# EAGLE design ece411-cdkm-main (EAGLE 5.10)
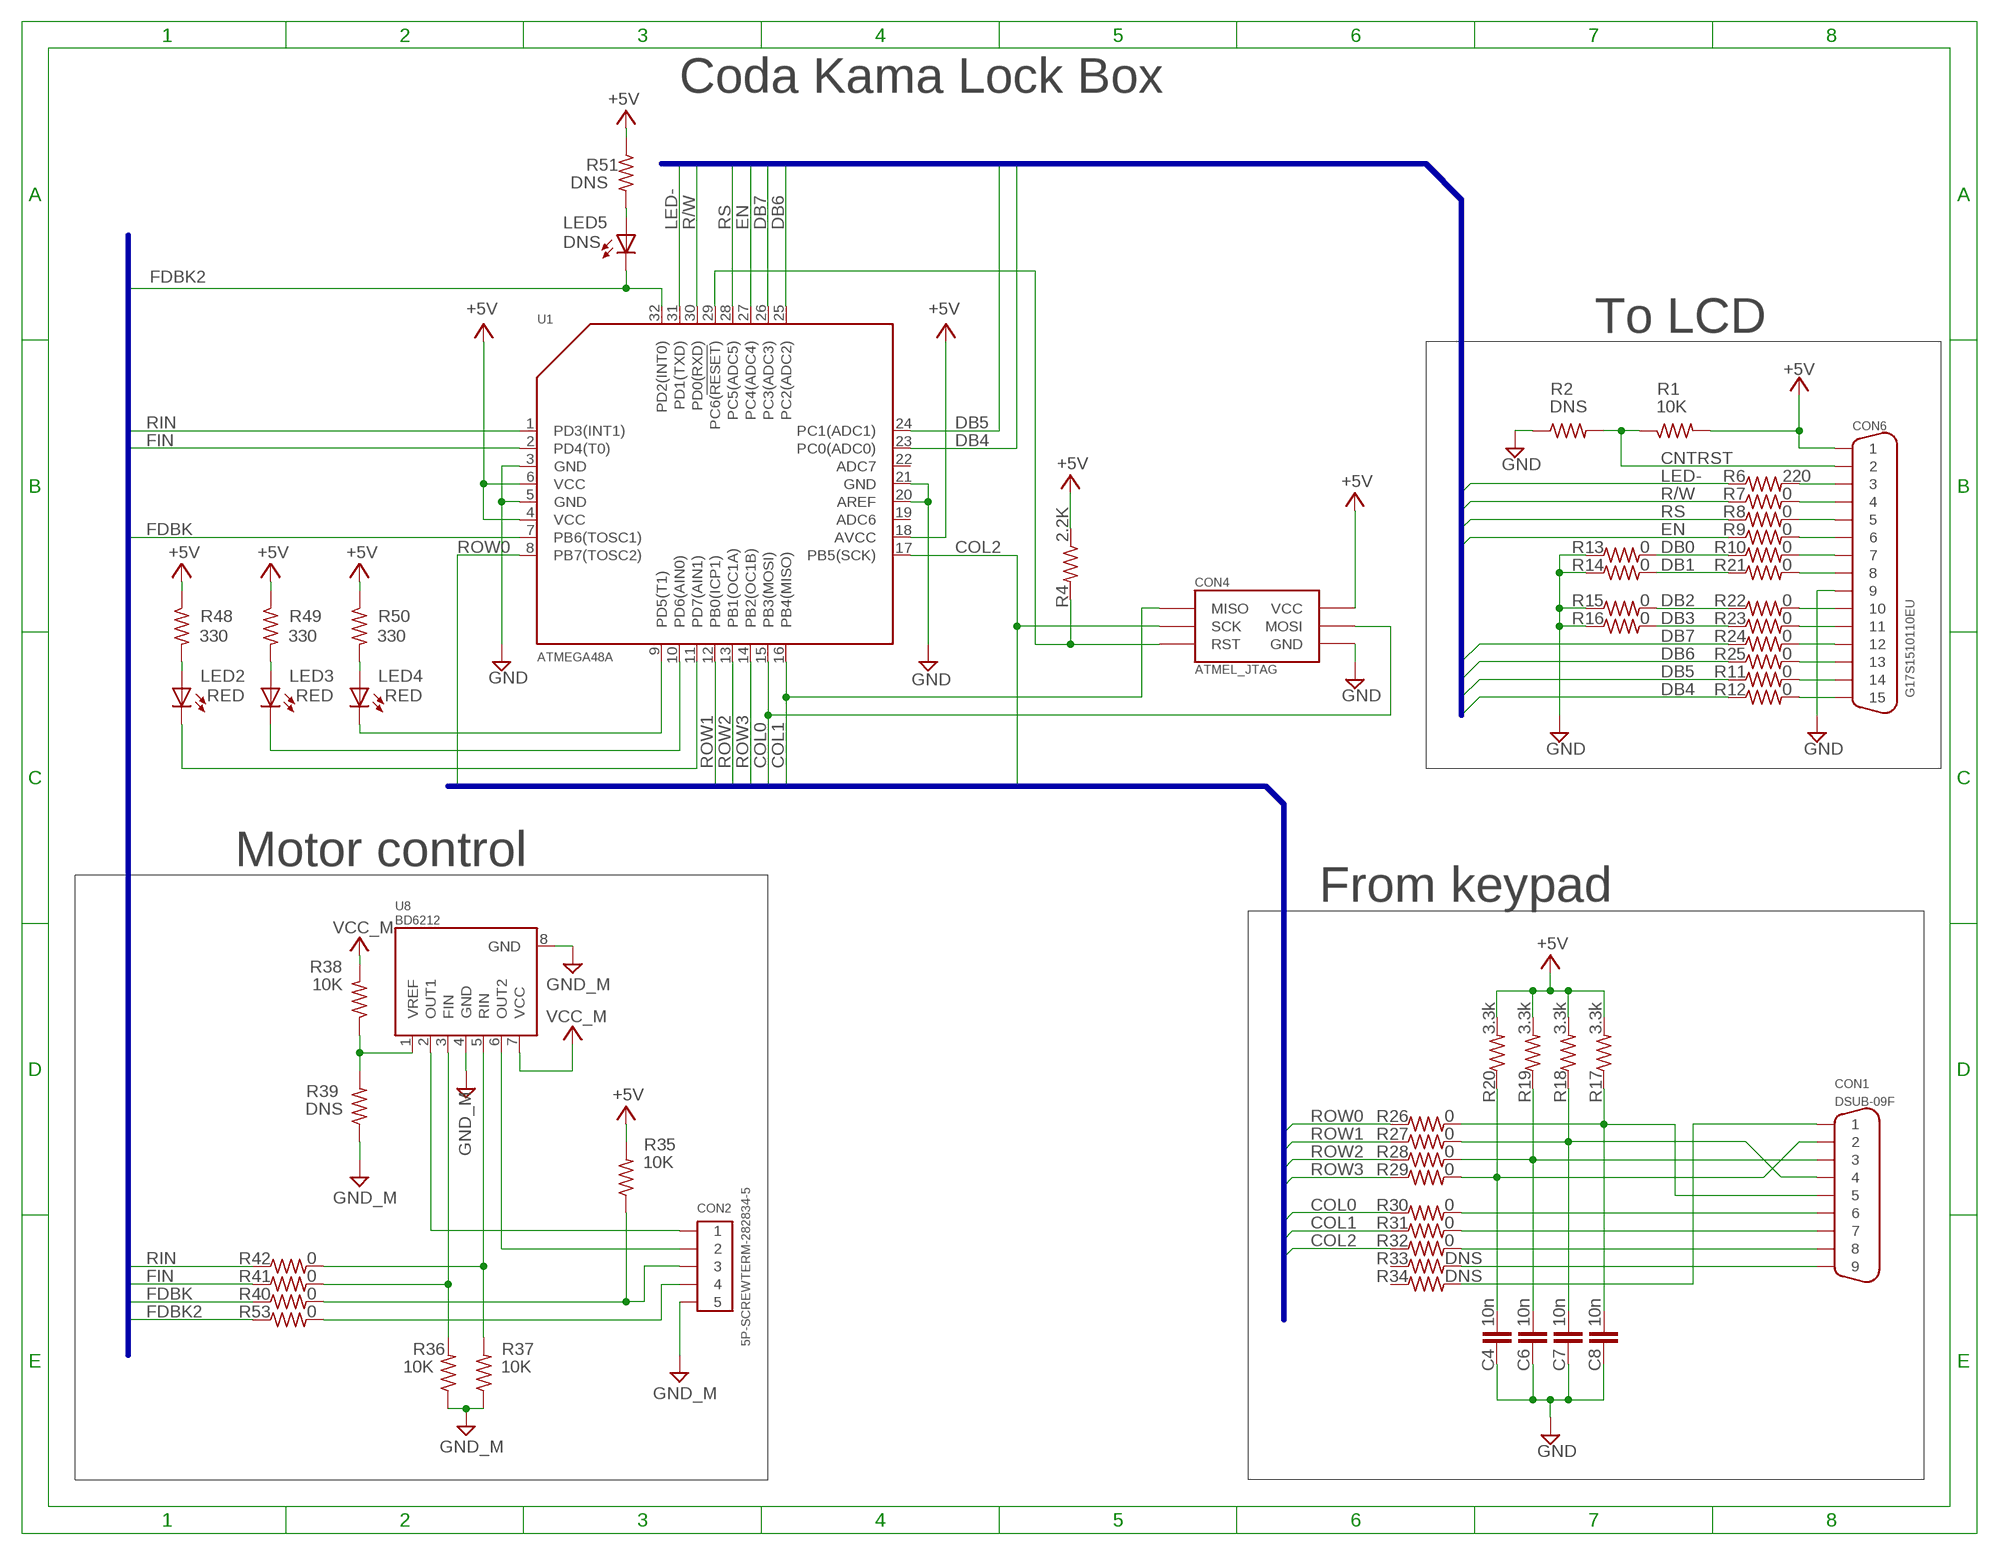
[diagram p0: schematic, sheet 1, part 1 of 2]
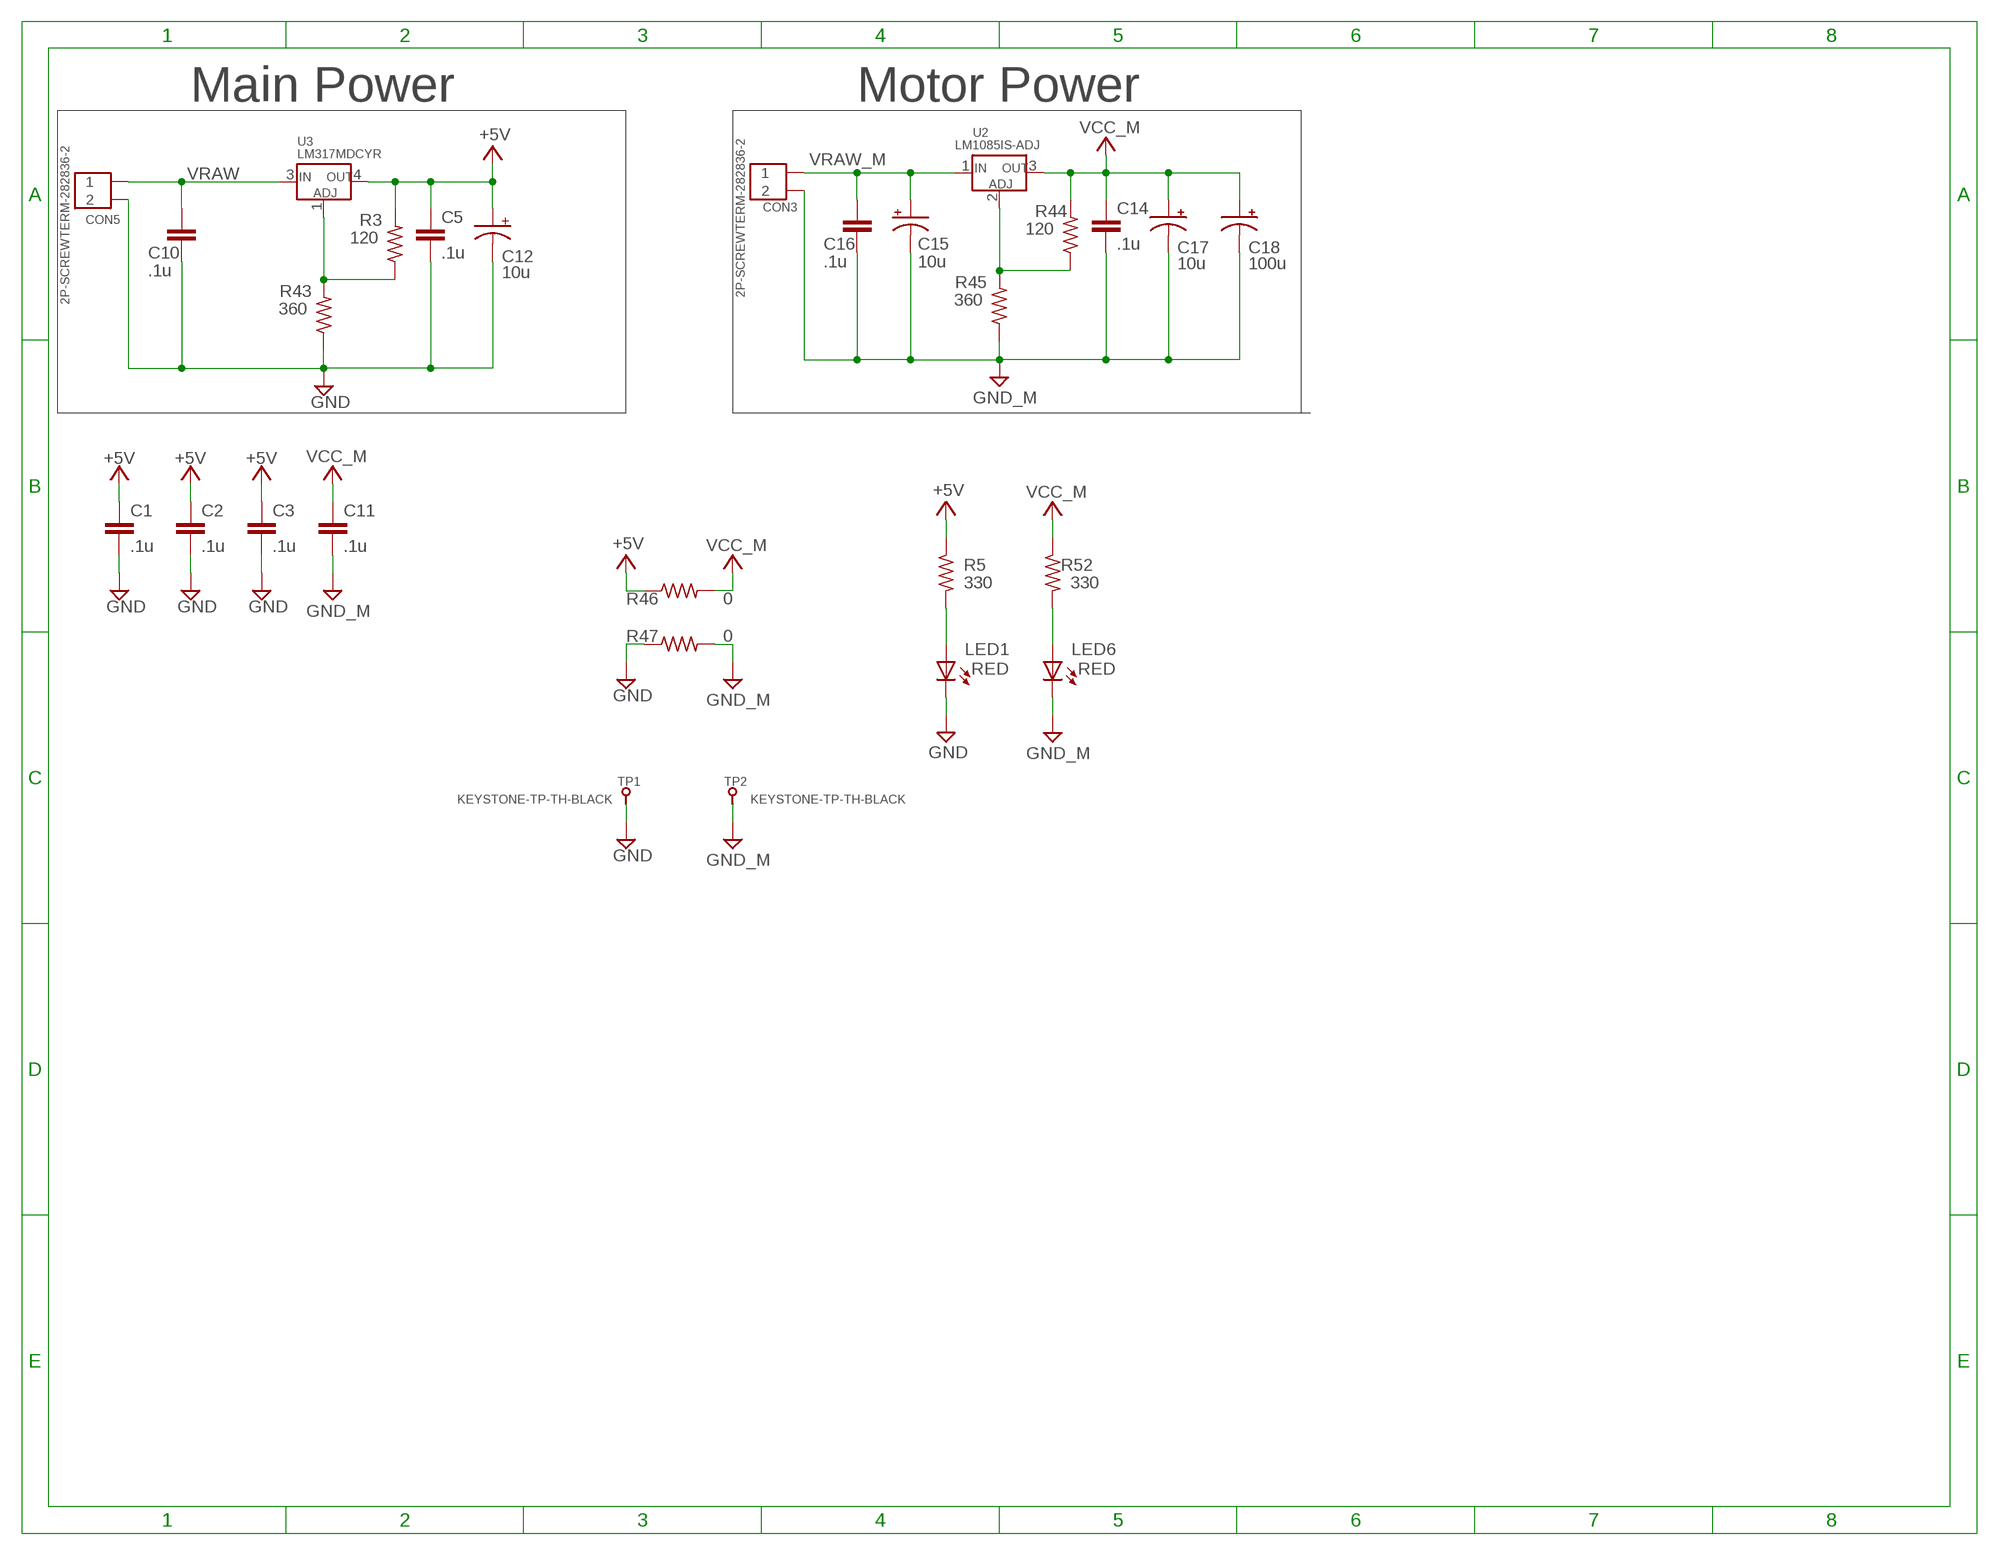
[diagram p1: schematic, sheet 1, part 2 of 2]

## Parts
C1  .1u  C-EUC0805  [C0805]
C2  .1u  C-EUC0805  [C0805]
C3  .1u  C-EUC0805  [C0805]
C4  10n  C-EUC0805  [C0805]
C5  .1u  C-EUC0805  [C0805]
C6  10n  C-EUC0805  [C0805]
C7  10n  C-EUC0805  [C0805]
C8  10n  C-EUC0805  [C0805]
C10  .1u  C-EUC0805  [C0805]
C11  .1u  C-EUC0805  [C0805]
C12  10u  CPOL-USE5-6  [E5-6]
C14  .1u  C-EUC0805  [C0805]
C15  10u  CPOL-USE5-6  [E5-6]
C16  .1u  C-EUC0805  [C0805]
C17  10u  CPOL-USE5-6  [E5-6]
C18  100u  CPOL-USE5-6  [E5-6]
CON1  DSUB-09F  [DSUB09M-SOLDER-EDGE]
CON2  5P-SCREWTERM-282834-5  [5P-TERMINALBLOCK-282834-5]
CON3  2P-SCREWTERM-282836-2  [2P-TERMINALBLOCK-282836-2]
CON4  ATMEL_JTAG  [3X2-100MIL]
CON5  2P-SCREWTERM-282836-2  [2P-TERMINALBLOCK-282836-2]
CON6  G17S1510110EU  DSUB-15F  [DSUB15F-SOLDER-EDGE]
LED1  RED  LEDCHIP-LED0805  [CHIP-LED0805]
LED2  RED  LEDCHIP-LED0805  [CHIP-LED0805]
LED3  RED  LEDCHIP-LED0805  [CHIP-LED0805]
LED4  RED  LEDCHIP-LED0805  [CHIP-LED0805]
LED5  DNS  LEDCHIP-LED0805  [CHIP-LED0805]
LED6  RED  LEDCHIP-LED0805  [CHIP-LED0805]
R1  10K  R-US_R0805  [R0805]
R2  DNS  R-US_R0805  [R0805]
R3  120  R-US_R0805  [R0805]
R4  2.2K  R-US_R0805  [R0805]
R5  330  R-US_R0805  [R0805]
R6  220  R-US_R0805  [R0805]
R7  0  R-US_R0805  [R0805]
R8  0  R-US_R0805  [R0805]
R9  0  R-US_R0805  [R0805]
R10  0  R-US_R0805  [R0805]
R11  0  R-US_R0805  [R0805]
R12  0  R-US_R0805  [R0805]
R13  0  R-US_R0805  [R0805]
R14  0  R-US_R0805  [R0805]
R15  0  R-US_R0805  [R0805]
R16  0  R-US_R0805  [R0805]
R17  3.3k  R-US_R0805  [R0805]
R18  3.3k  R-US_R0805  [R0805]
R19  3.3k  R-US_R0805  [R0805]
R20  3.3k  R-US_R0805  [R0805]
R21  0  R-US_R0805  [R0805]
R22  0  R-US_R0805  [R0805]
R23  0  R-US_R0805  [R0805]
R24  0  R-US_R0805  [R0805]
R25  0  R-US_R0805  [R0805]
R26  0  R-US_R0805  [R0805]
R27  0  R-US_R0805  [R0805]
R28  0  R-US_R0805  [R0805]
R29  0  R-US_R0805  [R0805]
R30  0  R-US_R0805  [R0805]
R31  0  R-US_R0805  [R0805]
R32  0  R-US_R0805  [R0805]
R33  DNS  R-US_R0805  [R0805]
R34  DNS  R-US_R0805  [R0805]
R35  10K  R-US_R0805  [R0805]
R36  10K  R-US_R0805  [R0805]
R37  10K  R-US_R0805  [R0805]
R38  10K  R-US_R0805  [R0805]
R39  DNS  R-US_R0805  [R0805]
R40  0  R-US_R0805  [R0805]
R41  0  R-US_R0805  [R0805]
R42  0  R-US_R0805  [R0805]
R43  360  R-US_R0805  [R0805]
R44  120  R-US_R0805  [R0805]
R45  360  R-US_R0805  [R0805]
R46  0  R-US_0207/10  [0207/10]
R47  0  R-US_0207/10  [0207/10]
R48  330  R-US_R0805  [R0805]
R49  330  R-US_R0805  [R0805]
R50  330  R-US_R0805  [R0805]
R51  DNS  R-US_R0805  [R0805]
R52  330  R-US_R0805  [R0805]
R53  0  R-US_R0805  [R0805]
TP1  KEYSTONE-TP-TH-BLACK  [KEYSTONE-TESTPOINT-MULTIPURPOSE]
TP2  KEYSTONE-TP-TH-BLACK  [KEYSTONE-TESTPOINT-MULTIPURPOSE]
U1  ATMEGA48A  [TQFP-32]
U2  LM1085IS-ADJ  [TO-263]
U3  LM317MDCYR  [DCY]
U8  BD6212  [HRP7]

## Nets
+5V: C1.1 C2.1 C3.1 C5.1 C12.+ CON4.P$6(VCC) CON6.1 R1.2 R3.2 R4.1 R5.1 R17.2 R18.2 R19.2 R20.2 R35.2 R46.1 R48.1 R49.1 R50.1 R51.1 U1.4(VCC) U1.6(VCC) U1.18(AVCC) U3.4(OUT)
CNTRST: CON6.2 R1.1 R2.2
COL0: CON4.P$5(MOSI) R30.1 U1.15(PB3(MOSI))
COL1: CON4.P$1(MISO) R31.1 U1.16(PB4(MISO))
COL2: CON4.P$2(SCK) R32.1 U1.17(PB5(SCK))
DB0: R10.1 R13.2
DB1: R14.2 R21.1
DB2: R15.2 R22.1
DB3: R16.2 R23.1
DB4: R12.1 U1.23(PC0(ADC0))
DB5: R11.1 U1.24(PC1(ADC1))
DB6: R25.1 U1.25(PC2(ADC2))
DB7: R24.1 U1.26(PC3(ADC3))
EN: R9.1 U1.27(PC4(ADC4))
FDBK: R40.1 U1.7(PB6(TOSC1))
FDBK2: LED5.C R53.1 U1.32(PD2(INT0))
FIN: R41.1 U1.2(PD4(T0))
GND: C1.2 C2.2 C3.2 C4.2 C5.2 C6.2 C7.2 C8.2 C10.2 C12.- CON4.P$4(GND) CON5.P$2 CON6.9 LED1.C R2.1 R13.1 R14.1 R15.1 R16.1 R43.1 R47.1 TP1.1 U1.3(GND) U1.5(GND) U1.20(AREF) U1.21(GND)
GND_M: C11.2 C14.2 C15.- C16.2 C17.- C18.- CON2.P$5 CON3.P$2 LED6.C R36.1 R37.1 R39.1 R45.1 R47.2 TP2.1 U8.4(GND) U8.8(GND)
LED-: R6.1 U1.31(PD1(TXD))
N$1: LED1.A R5.2
N$2: C8.1 CON1.P5 R17.1 R26.2
N$3: C7.1 CON1.P4 R18.1 R27.2
N$4: C6.1 CON1.P3 R19.1 R28.2
N$5: C4.1 CON1.P2 R20.1 R29.2
N$6: CON6.3 R6.2
N$7: CON6.4 R7.2
N$8: CON6.5 R8.2
N$9: CON6.6 R9.2
N$10: CON6.7 R10.2
N$11: CON6.10 R22.2
N$12: CON6.14 R11.2
N$13: CON6.15 R12.2
N$14: CON2.P$1 U8.2(OUT1)
N$15: CON1.P8 R32.2
N$16: CON1.P6 R30.2
N$17: CON1.P7 R31.2
N$18: R38.1 R39.2 U8.1(VREF)
N$19: CON1.P9 R33.2
N$20: CON1.P1 R34.2
N$21: CON2.P$2 U8.6(OUT2)
N$23: R3.1 R43.2 U3.1(ADJ)
N$25: R44.1 R45.2 U2.2(ADJ)
N$26: R37.2 R42.2 U8.5(RIN)
N$27: CON6.8 R21.2
N$28: R36.2 R41.2 U8.3(FIN)
N$29: CON6.11 R23.2
N$30: CON6.12 R24.2
N$31: CON6.13 R25.2
N$32: CON2.P$3 R35.1 R40.2
N$33: CON4.P$3(RST) R4.2 U1.29(PC6(!RESET!))
N$34: LED2.A R48.2
N$35: LED3.A R49.2
N$36: LED4.A R50.2
N$37: LED4.C U1.9(PD5(T1))
N$38: LED3.C U1.10(PD6(AIN0))
N$39: LED2.C U1.11(PD7(AIN1))
N$40: LED5.A R51.2
N$44: LED6.A R52.2
N$47: CON2.P$4 R53.2
R/W: R7.1 U1.30(PD0(RXD))
RIN: R42.1 U1.1(PD3(INT1))
ROW0: R26.1 U1.8(PB7(TOSC2))
ROW1: R27.1 U1.12(PB0(ICP1))
ROW2: R28.1 U1.13(PB1(OC1A))
ROW3: R29.1 U1.14(PB2(OC1B))
RS: R8.1 U1.28(PC5(ADC5))
VCC_M: C11.1 C14.1 C17.+ C18.+ R38.2 R44.2 R46.2 R52.1 U2.3(OUT) U8.7(VCC)
VRAW: C10.1 CON5.P$1 U3.3(IN)
VRAW_M: C15.+ C16.1 CON3.P$1 U2.1(IN)
Unconnected: R33.1 R34.1 U1.19(ADC6) U1.22(ADC7)

## Buses
LED-,RS,R/W,EN,DB[0..7]
COL[0..2],ROW[0..3]
FIN,RIN,FDBK,FDBK2

## Notes on the sheet
- Coda Kama Lock Box | Main Power | Motor Power
- To LCD
- Motor control
- From keypad

## Library data of the parts
C1-C8 C10 C11 C14 C16 = rcl:C-EU: CAPACITOR, European symbol
C12 C15 C17 C18 = rcl:CPOL-US: POLARIZED CAPACITOR, American symbol
CON1 = 000-ece411:DSUB-09F
CON2 = 000-ece411:5P-SCREWTERM-282834-5
CON3 CON5 = 000-ece411:2P-SCREWTERM-282836-2
CON4 = 000-ece411:ATMEL_JTAG
CON6 = 000-ece411:DSUB-15F
LED1-LED6 = led:LED: LED OSRAM: - CHIPLED LG R971, LG N971, LY N971, LG Q971, LY Q971, LO R971, LY R971 LH N974, LH R974 LS Q976, LO Q976, LY Q976 LO Q996 - Hyper CHIPLED LW Q18S LB Q993, LB Q99A, LB R99A - SideLED LS A670, LO A670, LY A670, LG A670, LP A670 LB A673, LV A673, LT A673, LW A673 LH A674 LY A675 LS A676, LA A676, LO A676, LY A676, LW A676 LS A679, LY A679, LG A679 - Hyper Micro SIDELED® LS Y876, LA Y876, LO Y876, LY Y876 LT Y87S - SmartLED LW L88C, LW L88S LB L89C, LB L89S, LG L890 LS L89K, LO L89K, LY L89K LS L896, LA L896, LO L896, LY L896 - TOPLED LS T670, LO T670, LY T670, LG T670, LP T670 LSG T670, LSP T670, LSY T670, LOP T670, LYG T670 LG T671, LOG T671, LSG T671 LB T673, LV T673, LT T673, LW T673 LH T674 LS T676, LA T676, LO T676, LY T676, LB T676, LH T676, LSB T676, LW T676 LB T67C, LV T67C, LT T67C, LS T67K, LO T67K, LY T67K, LW E67C LS E67B, LA E67B, LO E67B, LY E67B, LB E67C, LV E67C, LT E67C LW T67C LS T679, LY T679, LG T679 LS T770, LO T770, LY T770, LG T770, LP T770 LB T773, LV T773, LT T773, LW T773 LH T774 LS E675, LA E675, LY E675, LS T675 LS T776, LA T776, LO T776, LY T776, LB T776 LHGB T686 LT T68C, LB T68C - Hyper Mini TOPLED® LB M676 - Mini TOPLED Santana® LG M470 LS M47K, LO M47K, LY M47K Source: http://www.osram.convergy.de LUXEON: - LUMILED® LXK2-PW12-R00, LXK2-PW12-S00, LXK2-PW14-U00, LXK2-PW14-V00 LXK2-PM12-R00, LXK2-PM12-S00, LXK2-PM14-U00 LXK2-PE12-Q00, LXK2-PE12-R00, LXK2-PE12-S00, LXK2-PE14-T00, LXK2-PE14-U00 LXK2-PB12-K00, LXK2-PB12-L00, LXK2-PB12-M00, LXK2-PB14-N00, LXK2-PB14-P00, LXK2-PB14-Q00 LXK2-PR12-L00, LXK2-PR12-M00, LXK2-PR14-Q00, LXK2-PR14-R00 LXK2-PD12-Q00, LXK2-PD12-R00, LXK2-PD12-S00 LXK2-PH12-R00, LXK2-PH12-S00 LXK2-PL12-P00, LXK2-PL12-Q00, LXK2-PL12-R00 Source: www.luxeon.com KINGBRIGHT: KA-3528ASYC Source: www.kingbright.com
R1-R53 = rcl:R-US_: RESISTOR, American symbol
TP1 TP2 = 000-ece411:KEYSTONE-TP-TH-BLACK
U1 = 000-ece411:ATMEGA48A
U2 = 000-ece411:LM1085IS-ADJ
U3 = 000-ece411:LM317MDCYR
U8 = 000-ece411:BD6212

## Board
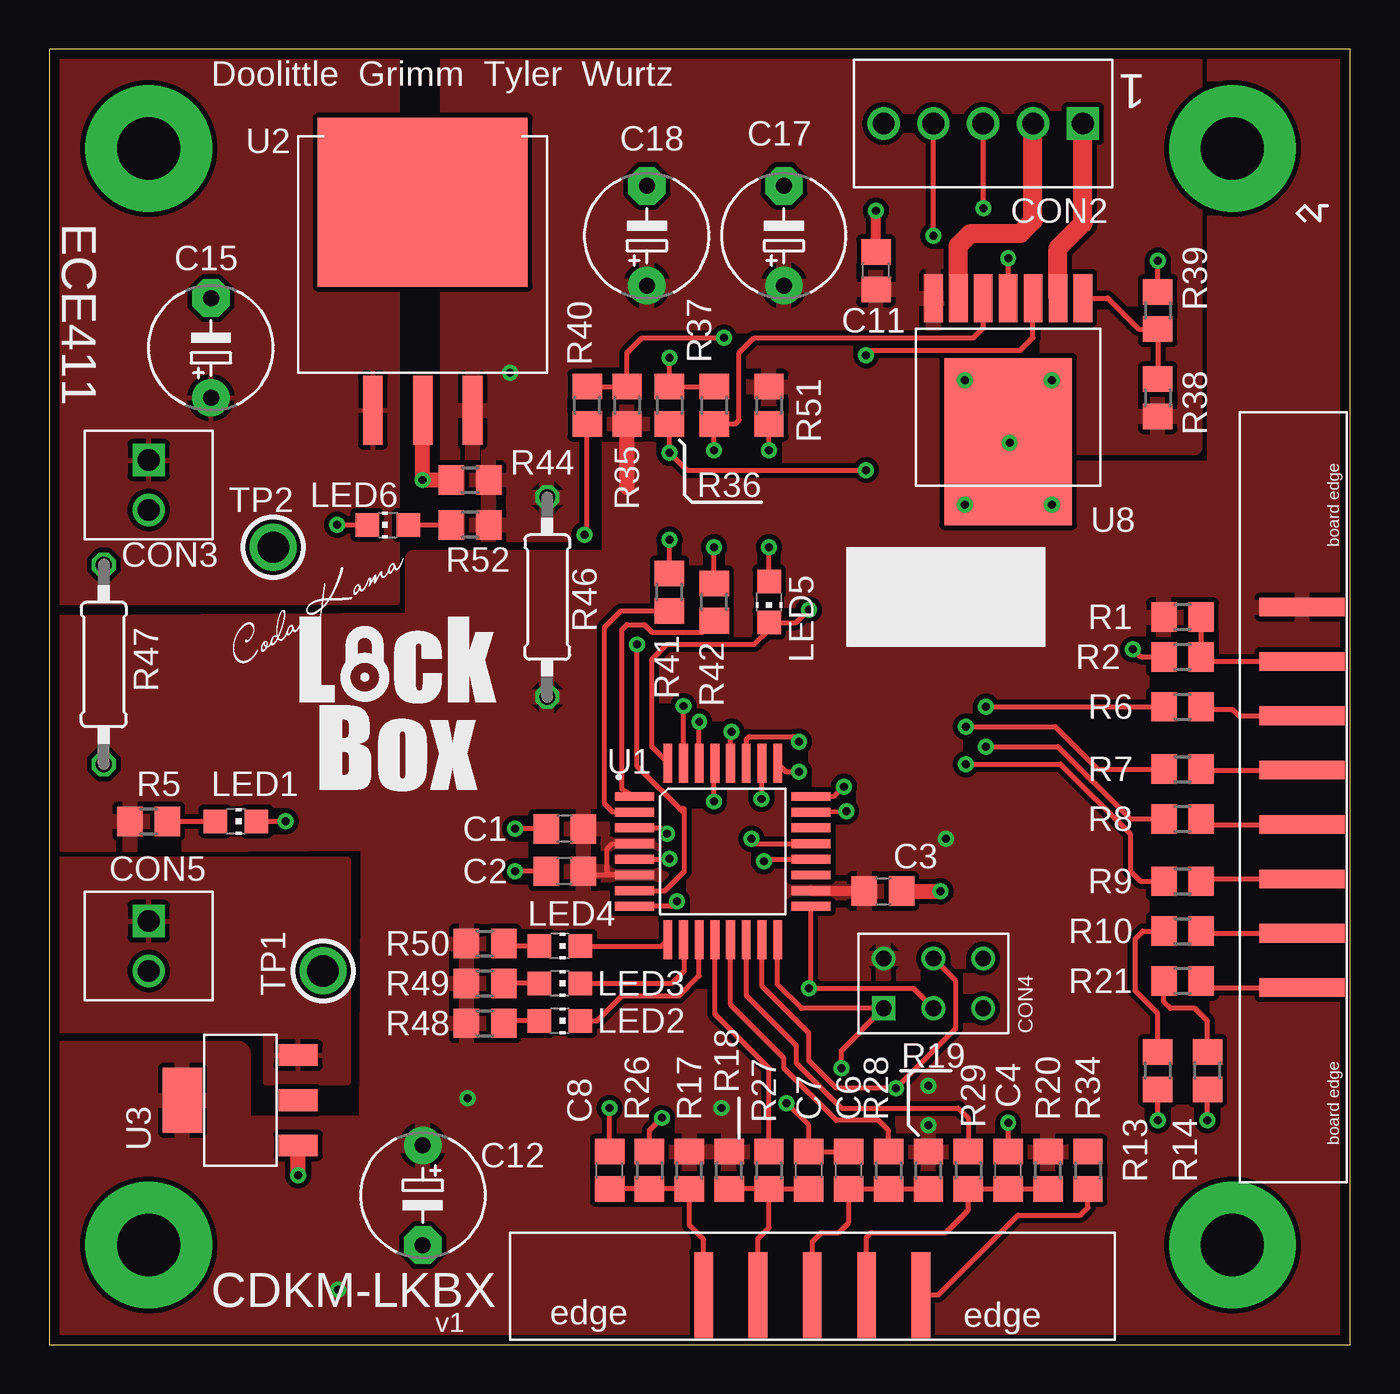
[diagram p2: board, top side]
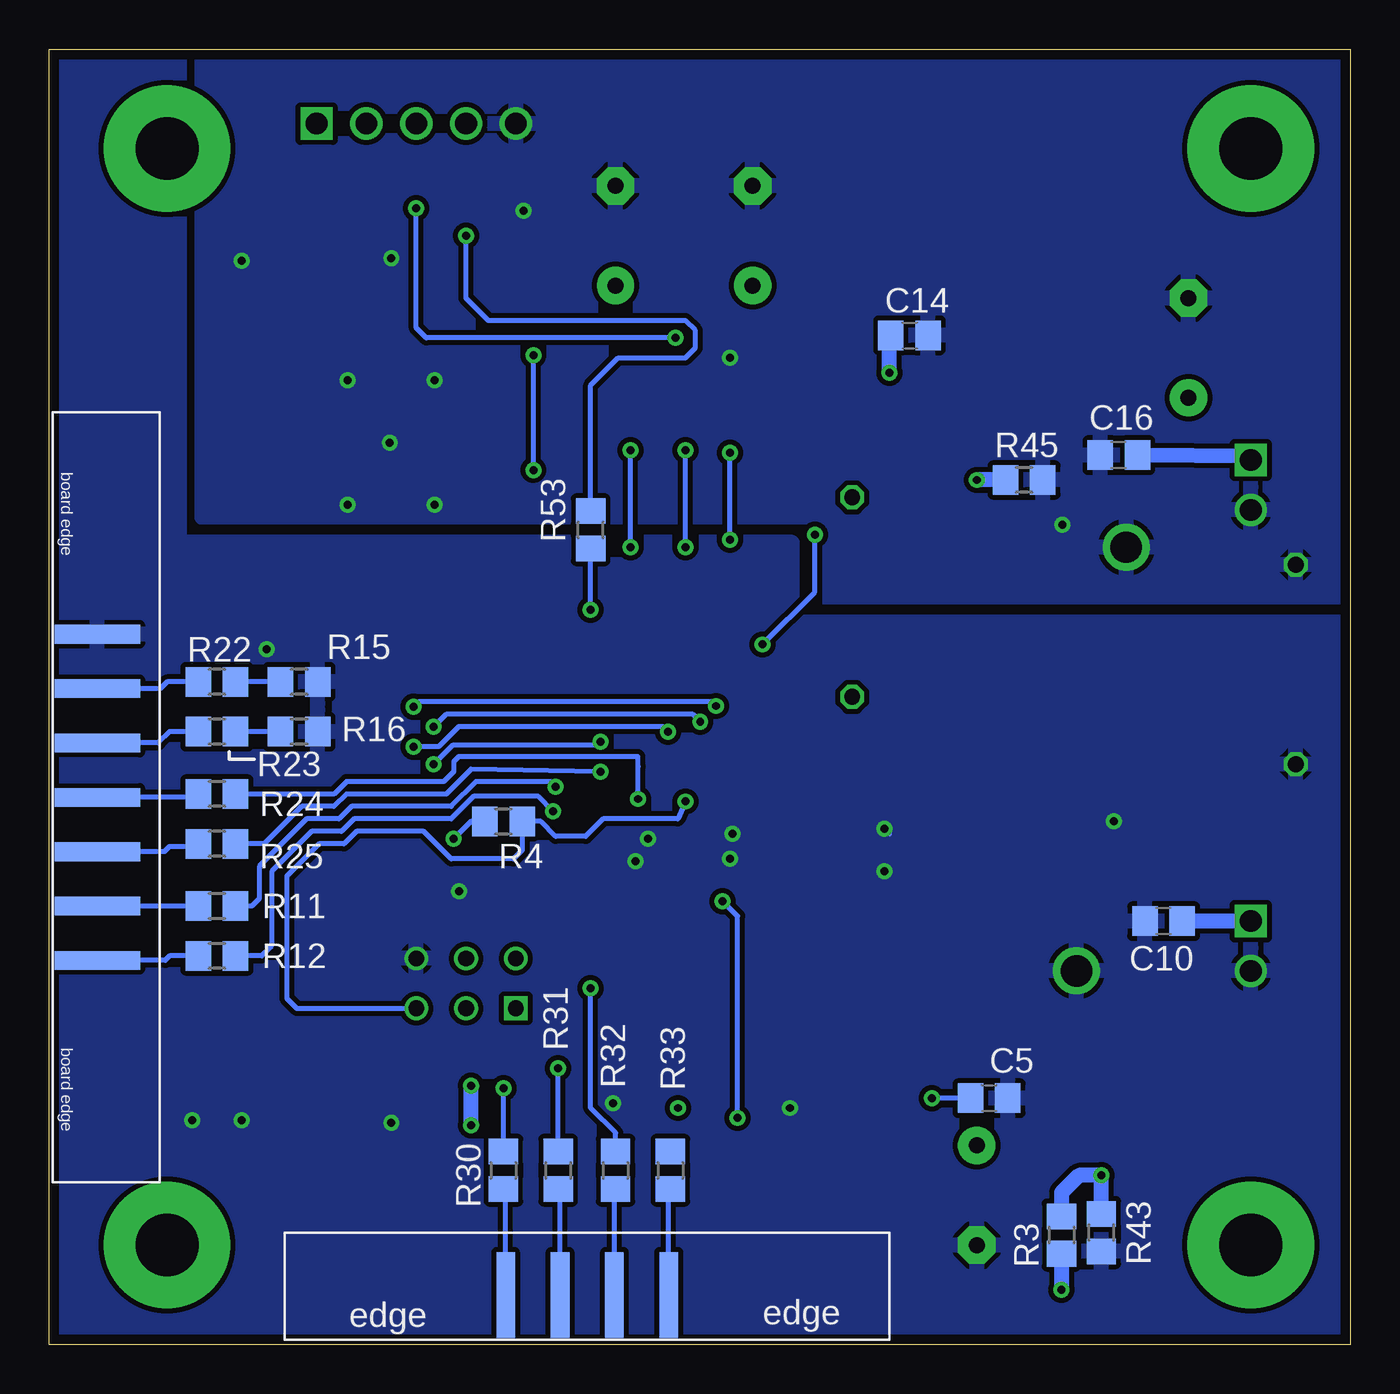
[diagram p3: board, bottom side, seen from below]

Size 66.34 x 66.03 mm. Coordinates in mm from the lower left corner, seen from the top.
Outline: 0,0 66.34,0 66.34,66.03 0,66.03 0,0
Copper layers (1*16): Top 0.0178mm / dielectric 1.4986mm / Bottom 0.0178mm
Design rules "sunstone-valueproto": minimum track width 7mil, minimum drill 16mil, track to track 7mil, track to pad 7mil, pad to pad 7mil, via to via 7mil, smd to smd 7mil, copper to edge 20mil, drill to drill 16mil, minimum pad ring 8mil, minimum via ring 8mil, stop-mask expansion 3mil, vias tented up to drill 0mil, thermal gap 10mil

### Footprints (pad centres in the part's own frame; a part is rotated, then mirrored left to right if it is on the bottom)
C0805 = smd 1.3 x 1.5: 1 -0.95,0; 2 0.95,0
E5-6 = drill 0.813 pad 1.905 round: + -2.54,0 | drill 0.813 pad 1.905 octagon: - 2.54,0
DSUB09M-SOLDER-EDGE = smd 4.35 x 0.95: P1 0,0; P2 0,-2.77; P3 0,-5.54; P4 0,-8.31; P5 0,-11.08 | smd 4.35 x 0.95 bottom: P6 0,-1.385; P7 0,-4.155; P8 0,-6.925; P9 0,-9.695
5P-TERMINALBLOCK-282834-5 = drill 1.1 square: P$1 0,0 | drill 1.1 round: P$2 2.54,0; P$3 5.08,0; P$4 7.62,0; P$5 10.16,0
2P-TERMINALBLOCK-282836-2 = drill 1.1 square: P$1 0,0 | drill 1.1 round: P$2 2.54,0
3X2-100MIL = drill 0.8 square: P$1 0,0 | drill 0.8 round: P$2 0,-2.54; P$3 0,-5.08; P$4 2.54,-5.08; P$5 2.54,-2.54; P$6 2.54,0
DSUB15F-SOLDER-EDGE = smd 4.35 x 0.95: 1 0,0; 2 0,-2.77; 3 0,-5.54; 4 0,-8.31; 5 0,-11.08; 6 0,-13.85; 7 0,-16.62; 8 0,-19.39 | smd 4.35 x 0.95 bottom: 9 0,-1.385; 10 0,-4.155; 11 0,-6.925; 12 0,-9.695; 13 0,-12.465; 14 0,-15.235; 15 0,-18.005
CHIP-LED0805 = smd 1.2 x 1.2: A 0,-1.05; C 0,1.05
R0805 = smd 1.3 x 1.5: 1 -0.95,0; 2 0.95,0
0207/10 = drill 0.813 octagon: 1 -5.08,0; 2 5.08,0
KEYSTONE-TESTPOINT-MULTIPURPOSE = drill 1.6 round: 1 0,0
TQFP-32 = smd 2 x 0.45: 1 0,0; 2 0,-0.8; 3 0,-1.6; 4 0,-2.4; 5 0,-3.2; 6 0,-4; 7 0,-4.8; 8 0,-5.6; 17 9,-5.6; 18 9,-4.8; 19 9,-4; 20 9,-3.2; 21 9,-2.4; 22 9,-1.6; 23 9,-0.8; 24 9,0 | smd 0.45 x 2: 9 1.7,-7.3; 10 2.5,-7.3; 11 3.3,-7.3; 12 4.1,-7.3; 13 4.9,-7.3; 14 5.7,-7.3; 15 6.5,-7.3; 16 7.3,-7.3; 25 7.3,1.7; 26 6.5,1.7; 27 5.7,1.7; 28 4.9,1.7; 29 4.1,1.7; 30 3.3,1.7; 31 2.5,1.7; 32 1.7,1.7
TO-263 = smd 1 x 3.5: 1 0,0; 2 2.54,0; 3 5.08,0 | smd 10.7 x 8.6: 4 2.54,10.6
DCY = smd 1.1 x 2: 1 0,0; 2 2.3,0; 3 4.6,0 | smd 3.3 x 2: 4 2.3,5.9
HRP7 = smd 0.95 x 2.445: 1 0,0; 2 1.27,0; 3 2.54,0; 4 3.81,0; 5 5.08,0; 6 6.35,0; 7 7.62,0 | smd 6.5 x 8.5: 8 3.81,7.316

### Placement (x,y rotation side)
C1  26.29,26.29 180 top
C2  26.29,24.13 180 top
C3  42.51,23.11 0 top
C4  48.9,8.89 90 top
C5  18.41,12.57 0 bottom
C6  40.77,8.89 90 top
C7  38.73,8.89 90 top
C8  28.57,8.89 90 top
C10  9.53,21.59 180 bottom
C11  42.16,54.74 90 top
C12  19.05,7.62 270 top
C14  22.48,51.44 0 bottom
C15  8.26,50.8 90 top
C16  11.81,45.34 180 bottom
C17  37.47,56.52 90 top
C18  30.48,56.52 90 top
CON1  44.45,2.54 270 top
CON2  52.7,62.23 180 top
CON3  5.08,45.09 270 top
CON4  42.55,17.14 90 top
CON5  5.08,21.59 270 top
CON6  63.88,37.59 0 top
LED1  9.53,26.67 270 top
LED2  26.04,16.51 270 top
LED3  26.04,18.41 270 top
LED4  26.04,20.32 270 top
LED5  36.7,37.85 180 top
LED6  17.27,41.78 90 top
R1  57.78,37.08 180 top
R2  57.78,35.05 0 top
R3  14.73,5.59 270 bottom
R4  43.18,26.67 0 bottom
R5  5.08,26.67 0 top
R6  57.78,32.51 0 top
R7  57.78,29.34 0 top
R8  57.78,26.8 0 top
R9  57.78,23.62 0 top
R10  57.78,21.08 0 top
R11  57.78,22.35 180 bottom
R12  57.78,19.81 180 bottom
R13  56.52,13.97 90 top
R14  59.05,13.97 90 top
R15  53.59,33.78 180 bottom
R16  53.59,31.24 180 bottom
R17  32.64,8.89 90 top
R18  34.67,8.89 90 top
R19  44.83,8.89 90 top
R20  50.93,8.89 90 top
R21  57.78,18.54 0 top
R22  57.78,33.78 180 bottom
R23  57.78,31.24 180 bottom
R24  57.78,28.07 180 bottom
R25  57.78,25.53 180 bottom
R26  30.61,8.89 270 top
R27  36.7,8.89 270 top
R28  42.8,8.89 270 top
R29  46.86,8.89 270 top
R30  43.18,8.89 270 bottom
R31  40.39,8.89 270 bottom
R32  37.47,8.89 270 bottom
R33  34.67,8.89 270 bottom
R34  52.96,8.89 270 top
R35  29.46,47.88 270 top
R36  31.62,47.88 270 top
R37  33.91,47.88 270 top
R38  56.52,48.26 270 top
R39  56.52,52.7 270 top
R40  27.43,47.88 90 top
R41  31.62,38.35 90 top
R42  33.91,37.85 90 top
R43  12.7,5.71 90 bottom
R44  21.46,44.07 0 top
R45  16.64,44.07 180 bottom
R46  25.4,38.1 90 top
R47  2.79,34.67 90 top
R48  22.23,16.38 0 top
R49  22.23,18.41 0 top
R50  22.23,20.45 0 top
R51  36.7,47.88 270 top
R52  21.46,41.78 180 top
R53  38.73,41.53 90 bottom
TP1  13.97,19.05 0 top
TP2  11.43,40.64 0 top
U1  29.84,27.94 0 top
U2  16.51,47.62 0 top
U3  12.7,10.16 90 top
U8  52.7,53.34 180 top

### Tracks (layer width: path | path; a pad name or v marks a point on that pad's centre or on a via)
+5V  (via drill 0.41 pad 0.41)
  Top 0.254: 28.64,23.94 U1.6 28.57,23.94 | U1.4 28.7,25.53 28.45,25.27 28.45,24.07 28.57,23.94 | C2.1 27.43,23.94 28.57,23.94
  Top 0.508: U1.18 41.54,23.14 C3.1
  Top 0.762: 29.46,43.69 R35.2
  Bottom 0.254: R4.1 44.83,26.67 v45.72,25.78 | C5.1 v21.34,12.57
  Bottom 0.762: v44.83,11.18 v44.83,13.21 | R3.2 v14.73,2.79
  other vias: 34.29,12.06
  pour Top (isolate 0.254, rank 2): 0,0 0,15.11 9.59,15.11 arc-90 9.91,14.8 9.91,11.3 16.19,11.3 16.26,22.61 16.26,25.53 0.95,25.4 arc-90 0.64,25.72 0.64,36.83 18.54,36.96 18.54,40.13 28.57,40.13 28.57,50.8 45.09,50.8 45.09,44.7 59.44,44.7 59.44,66.04 66.29,66.04 66.29,0
CNTRST
  Top 0.254: R1.1 R2.2 58.97,34.82 CON6.2
COL0  (via drill 0.41)
  Top 0.254: CON4.P$5 46.23,18.54 46.23,16.13 v43.18,13.08 40.13,13.08 38.73,14.48 38.73,15.88 36.34,18.27 U1.15
  Bottom 0.254: R30.1 v43.18,13.08
COL1  (via drill 0.41 pad 0.41)
  Top 0.254: v40.39,14.1 40.39,14.99 CON4.P$1 38.35,17.14 37.15,18.35 U1.16
  Bottom 0.254: R31.1 v40.39,14.1
COL2  (via drill 0.41 pad 0.41)
  Top 0.254: CON4.P$2 44.07,18.16 v38.73,18.16 38.84,18.27 U1.17
  Bottom 0.254: R32.1 37.47,10.79 38.73,12.06 v38.73,18.16
DB0
  Top 0.254: 56.52,15.88 R13.2 56.52,16.89 55.37,18.03 55.37,20.7 55.75,21.08 R10.1
DB1
  Top 0.254: R21.1 56.84,17.46 57.15,17.14 58.42,17.14 59.05,16.51 R14.2
DB2
  Bottom 0.254: R15.2 R22.1
DB3
  Bottom 0.254: R16.2 R23.1
DB4  (via drill 0.41 pad 0.41)
  Top 0.254: U1.23 39.03,27.14 v40.64,27.18
  Bottom 0.254: R12.1 55.5,19.81 55.08,20.23 arc-45 54.99,20.45 54.99,24.13 52.96,26.16 51.44,26.16 50.8,26.8 45.85,26.8 44.7,27.94 41.4,27.94 v40.64,27.18
DB5  (via drill 0.41 pad 0.41)
  Top 0.254: U1.24 40.01,27.94 v40.51,28.45
  Bottom 0.254: R11.1 56.01,22.35 55.63,22.73 55.63,24.38 53.21,26.8 51.56,26.8 50.93,27.43 45.85,27.43 44.58,28.7 40.77,28.7 v40.51,28.45
DB6  (via drill 0.41 pad 0.41)
  Top 0.254: U1.25 37.58,29.21 v38.23,29.21
  Bottom 0.254: v38.23,29.21 44.83,29.34 46.1,28.07 51.18,28.07 51.82,27.43 53.47,27.43 55.37,25.53 R25.1
DB7  (via drill 0.41 pad 0.41)
  Top 0.254: U1.26 36.34,27.84 v36.31,27.81
  Bottom 0.254: R24.1 51.82,28.07 51.18,28.7 46.23,28.7 45.72,29.21 45.72,29.72 45.47,29.97 36.32,29.97 36.31,29.46 v36.31,27.81
EN  (via drill 0.41, 0.41 pad 0.41)
  Top 0.254: R9.1 55.63,23.62 55.12,24.13 55.12,26.04 51.56,29.59 v46.74,29.59 | U1.27 35.55,30.85 35.69,30.99 37.97,30.99 v38.23,30.73
  Bottom 0.254: v46.74,29.59 45.78,30.54 38.42,30.54 v38.23,30.73
FDBK  (via drill 0.41)
  Top 0.254: U1.7 31.39,23.14 32.38,24.13 32.38,27.08 | 32.38,27.08 32.38,27.3 32.13,27.3 | 32.38,27.08 29.97,29.49 v29.97,35.69 | v27.3,41.27 27.43,41.4 R40.1
  Bottom 0.254: v29.97,35.69 27.3,38.35 v27.3,41.27
FDBK2  (via drill 0.41)
  Top 0.254: v38.73,37.47 38.07,36.8 LED5.C 36.7,36.45 35.94,35.69 31.5,35.69 30.73,34.92 30.73,30.48 31.55,29.67 U1.32
  Bottom 0.254: v38.73,37.47 R53.1
FIN
  Top 0.254: R41.1 29.15,37.4 28.32,36.58 28.32,27.56 28.74,27.14 U1.2
GND  (via drill 0.41 pad 0.41)
  Top 0.254: C1.2 v23.75,26.29 | C2.2 v23.75,24.13 | U1.3 31.19,26.34 v31.5,26.04 | U1.20 36.55,24.74 v36.45,24.64 | R2.1 55.76,35.05 arc-45 55.53,35.15 v55.24,35.43 | v35.81,25.78 36.05,25.54 U1.21 | v56.52,11.43 R13.1 | v59.05,11.43 R14.1 | C4.2 v48.9,11.3 | C6.2 C7.2 38.73,11.18 v37.59,12.32 | C8.2 v28.57,12.06 | LED1.C v12.06,26.67 | U1.5 31.6,24.74 v31.62,24.77
  Top 0.762: C3.2 v45.43,23.11
  Bottom 0.254: v23.75,26.29 23.5,26.29 23.5,26.04
  pour Bottom (isolate 0.254): 0,0 0,36.83 28.45,36.83 28.45,40.89 59.69,40.89 59.69,66.04 66.04,66.04 66.04,0
GND_M  (via drill 0.41 pad 0.41)
  Top 0.254: R39.1 v56.52,55.24 | R37.1 R36.1 v31.62,50.29 | U8.4 v48.9,55.37 | v14.68,41.78 LED6.C
  Top 0.406: U8.8 48.9,46.99 47.62,45.72 47.62,46.99 47.95,46.99 v48.97,45.97
  Top 0.508: C11.2 v42.16,57.78
  Top 0.762: U8.8 48.82,46.1
  other vias: 46.69,49.15 51.13,49.15 51.13,42.8 46.69,42.8
  pour Bottom (isolate 0.254): 0,38.1 27.3,38.1 27.3,42.16 58.55,42.16 58.55,66.04 0,66.04
LED-  (via drill 0.41, 0.41 pad 0.41)
  Top 0.254: v47.75,32.51 R6.1 | U1.31 v32.34,32.55 32.32,31.81
  Bottom 0.254: v32.34,32.55 32.56,32.77 47.5,32.77 v47.75,32.51
N$1
  Top 0.254: R5.2 LED1.A
N$2
  Top 0.254: C8.1 R26.2 R17.1 32.64,6.1 33.37,5.37 CON1.P5
N$3
  Top 0.254: R27.2 C7.1 | R27.2 R18.1 | CON1.P4 36.14,5.41 36.7,5.97 R27.2
N$4
  Top 0.254: R19.1 R28.2 C6.1 40.77,6.22 40.26,5.71 39.37,5.71 38.91,5.25 CON1.P3
N$5
  Top 0.254: CON1.P2 41.68,5.49 41.91,5.71 45.72,5.71 46.86,6.86 R29.2 C4.1 R20.1
N$6
  Top 0.254: R6.2 58.86,32.38 60.33,32.38 60.66,32.05 CON6.3
N$7
  Top 0.254: R7.2 58.79,29.28 CON6.4
N$8
  Top 0.254: R8.2 59.02,26.51 CON6.5
N$9
  Top 0.254: R9.2 58.85,23.74 CON6.6
N$10
  Top 0.254: R10.2 58.84,20.97 CON6.7
N$11
  Bottom 0.254: R22.2 60.33,33.78 60.67,33.44 CON6.10
N$12
  Bottom 0.254: R11.2 CON6.14
N$13
  Bottom 0.254: R12.2 60.2,19.81 60.42,19.59 CON6.15
N$14
  Top 0.965: U8.2 51.44,55.88 52.7,57.15 CON2.P$1
N$15
  Bottom 0.254: R32.2 37.52,7.88 CON1.P8
N$16
  Bottom 0.254: R30.2 43.06,7.83 CON1.P6
N$17
  Bottom 0.254: R31.2 40.3,7.85 CON1.P7
N$18
  Top 0.254: U8.1 53.98,53.34 55.56,51.76 R39.2 R38.1
N$19
  Bottom 0.254: R33.2 34.76,7.86 CON1.P9
N$20
  Top 0.254: CON1.P1 45.34,2.54 49.4,6.6 52.58,6.6 52.96,6.99 R34.2
N$21
  Top 0.965: U8.6 46.35,56.01 46.99,56.64 49.53,56.64 50.16,57.28 CON2.P$2
N$22  (via drill 3.2 pad 6.45)
  other vias: 5.08,5.08
N$23  (via drill 0.41 pad 0.41)
  Top 0.762: v12.7,8.64 U3.1
  Bottom 0.762: R43.2 v12.7,8.64 13.84,8.64 14.73,7.75 R3.1
N$24  (via drill 3.2 pad 6.45)
  other vias: 60.33,5.08
N$25  (via drill 0.41 pad 0.41)
  Top 0.254: R44.1 20.57,44.13
  Top 0.762: U2.2 v19.05,44.07 R44.1
  Bottom 0.762: R45.2 v19.05,44.07
N$26  (via drill 0.41 pad 0.41)
  Top 0.254: U8.5 47.62,51.82 47.12,51.31 35.94,51.31 35.18,50.55 35.18,47.12 34.99,46.93 R37.2 v33.91,45.59 | R42.2 v33.91,40.64
  Bottom 0.254: v33.91,40.64 v33.91,45.59
N$27
  Top 0.254: R21.2 59.08,18.2 CON6.8
N$28  (via drill 0.41 pad 0.41)
  Top 0.254: U8.3 50.16,51.31 49.53,50.67 41.91,50.67 v41.66,50.42 | R36.2 v31.62,45.47 32.51,44.58 v41.66,44.58 | R41.2 v31.62,41.02
  Bottom 0.254: v31.62,41.02 v31.62,45.47 | v41.66,44.58 v41.66,50.42
N$29
  Bottom 0.254: R23.2 60.2,31.24 60.77,30.67 CON6.11
N$30
  Bottom 0.254: R24.2 58.91,27.9 CON6.12
N$31
  Bottom 0.254: R25.2 58.86,25.4 60.2,25.4 60.47,25.13 CON6.13
N$32  (via drill 0.41, 0.41 pad 0.41)
  Top 0.254: v34.42,51.31 30.23,51.31 29.46,50.55 R35.1 R40.2 | v47.62,57.91 CON2.P$3
  Bottom 0.254: v34.42,51.31 47.12,51.31 47.62,51.82 v47.62,57.91
N$33  (via drill 0.41 pad 0.41)
  Top 0.254: U1.29 33.9,29.1 v33.9,27.69
  Bottom 0.254: v33.9,27.69 34.29,26.8 38.1,26.8 38.99,25.91 40.51,25.91 41.27,26.67 R4.2 42.23,25.21 42.67,24.77 45.85,24.77 47.24,26.16 50.67,26.16 51.31,25.53 52.58,25.53 54.23,23.88 54.23,17.65 53.72,17.14 CON4.P$3
N$34
  Top 0.254: R48.2 23.18,16.51 LED2.A
N$35
  Top 0.254: LED3.A R49.2
N$36
  Top 0.254: R50.2 23.18,20.32 LED4.A
N$37
  Top 0.254: U1.9 31.23,20.32 LED4.C
N$38
  Top 0.254: U1.10 32.38,20.6 32.38,19.05 31.75,18.41 LED3.C
N$39
  Top 0.254: LED2.C 27.94,16.51 29.21,17.78 32.13,17.78 33.15,18.79 U1.11
N$40  (via drill 0.41 pad 0.41)
  Top 0.254: v36.7,45.59 R51.2 | LED5.A v36.7,40.64
  Bottom 0.254: v36.7,40.64 v36.7,45.59
N$42  (via drill 3.2 pad 6.45)
  other vias: 60.33,60.96
N$43  (via drill 3.2 pad 6.45)
  other vias: 5.08,60.96
N$44
  Top 0.254: LED6.A R52.2
N$47  (via drill 0.41)
  Top 0.254: v45.09,56.52 CON2.P$4
  Bottom 0.254: v45.09,56.52 45.09,53.34 43.94,52.2 33.91,52.2 33.4,51.69 33.4,50.8 33.91,50.29 37.34,50.29 38.73,48.9 R53.2
R/W  (via drill 0.41 pad 0.41)
  Top 0.254: v46.74,31.5 51.31,31.5 53.47,29.34 R7.1 | U1.30 v33.15,31.75
  Bottom 0.254: v33.15,31.75 33.53,32.13 46.1,32.13 v46.74,31.5
RIN
  Top 0.254: 33.91,36.83 R42.1 33.34,36.32 30.73,36.32 30.35,36.7 29.46,36.7 29.21,36.45 29.21,28.32 U1.1
ROW0  (via drill 0.41, 0.41 pad 0.41)
  Top 0.254: R26.1 30.61,10.92 v31.24,11.56 | U1.8 31.74,22.34 v32,22.61
  Bottom 0.254: v32,22.61 31.24,21.84 v31.24,11.56
ROW1
  Top 0.254: R27.1 36.7,14.1 33.95,16.86 U1.12
ROW2
  Top 0.254: R28.1 42.8,10.92 42.29,11.43 40.13,11.43 37.47,14.1 37.47,14.61 34.74,17.32 U1.13
ROW3
  Top 0.254: R29.1 46.86,11.56 46.35,12.06 40.39,12.06 38.1,14.35 38.1,15.24 35.55,17.8 U1.14
RS  (via drill 0.41, 0.41 pad 0.41)
  Top 0.254: R8.1 55.12,26.8 51.44,30.48 v47.75,30.48 | U1.28 34.74,31.19 v34.8,31.24
  Bottom 0.254: v47.75,30.48 46.48,30.48 45.47,31.5 35.05,31.5 v34.8,31.24
VCC_M  (via drill 0.41 pad 0.41)
  Bottom 0.762: C14.1 arc-90 23.5,51.37 v23.5,49.53
  pour Top (isolate 0.254, rank 3): 20.32,41.27 20.32,66.04 58.42,66.04 58.42,45.72 40.01,45.72 40.01,50.16 27.3,50.16 27.3,41.27
VRAW
  Bottom 0.762: CON5.P$1 C10.1
  pour Top (isolate 0.254): 0,24.77 15.24,24.77 15.24,13.34 11.05,13.34 11.05,16 0,16 0,17.27
VRAW_M
  Bottom 0.762: CON3.P$1 5.08,45.27 C16.1
  pour Top (isolate 0.254): 0,66.04 0,37.85 17.78,37.85 17.78,66.04

### Text on the board
tNames: 1 | Doolittle Grimm Tyler Wurtz | ECE411 | CDKM-LKBX | v1